# EAGLE design Breeze UAV (EAGLE 7.1.0)

## Sheet 1 of 2
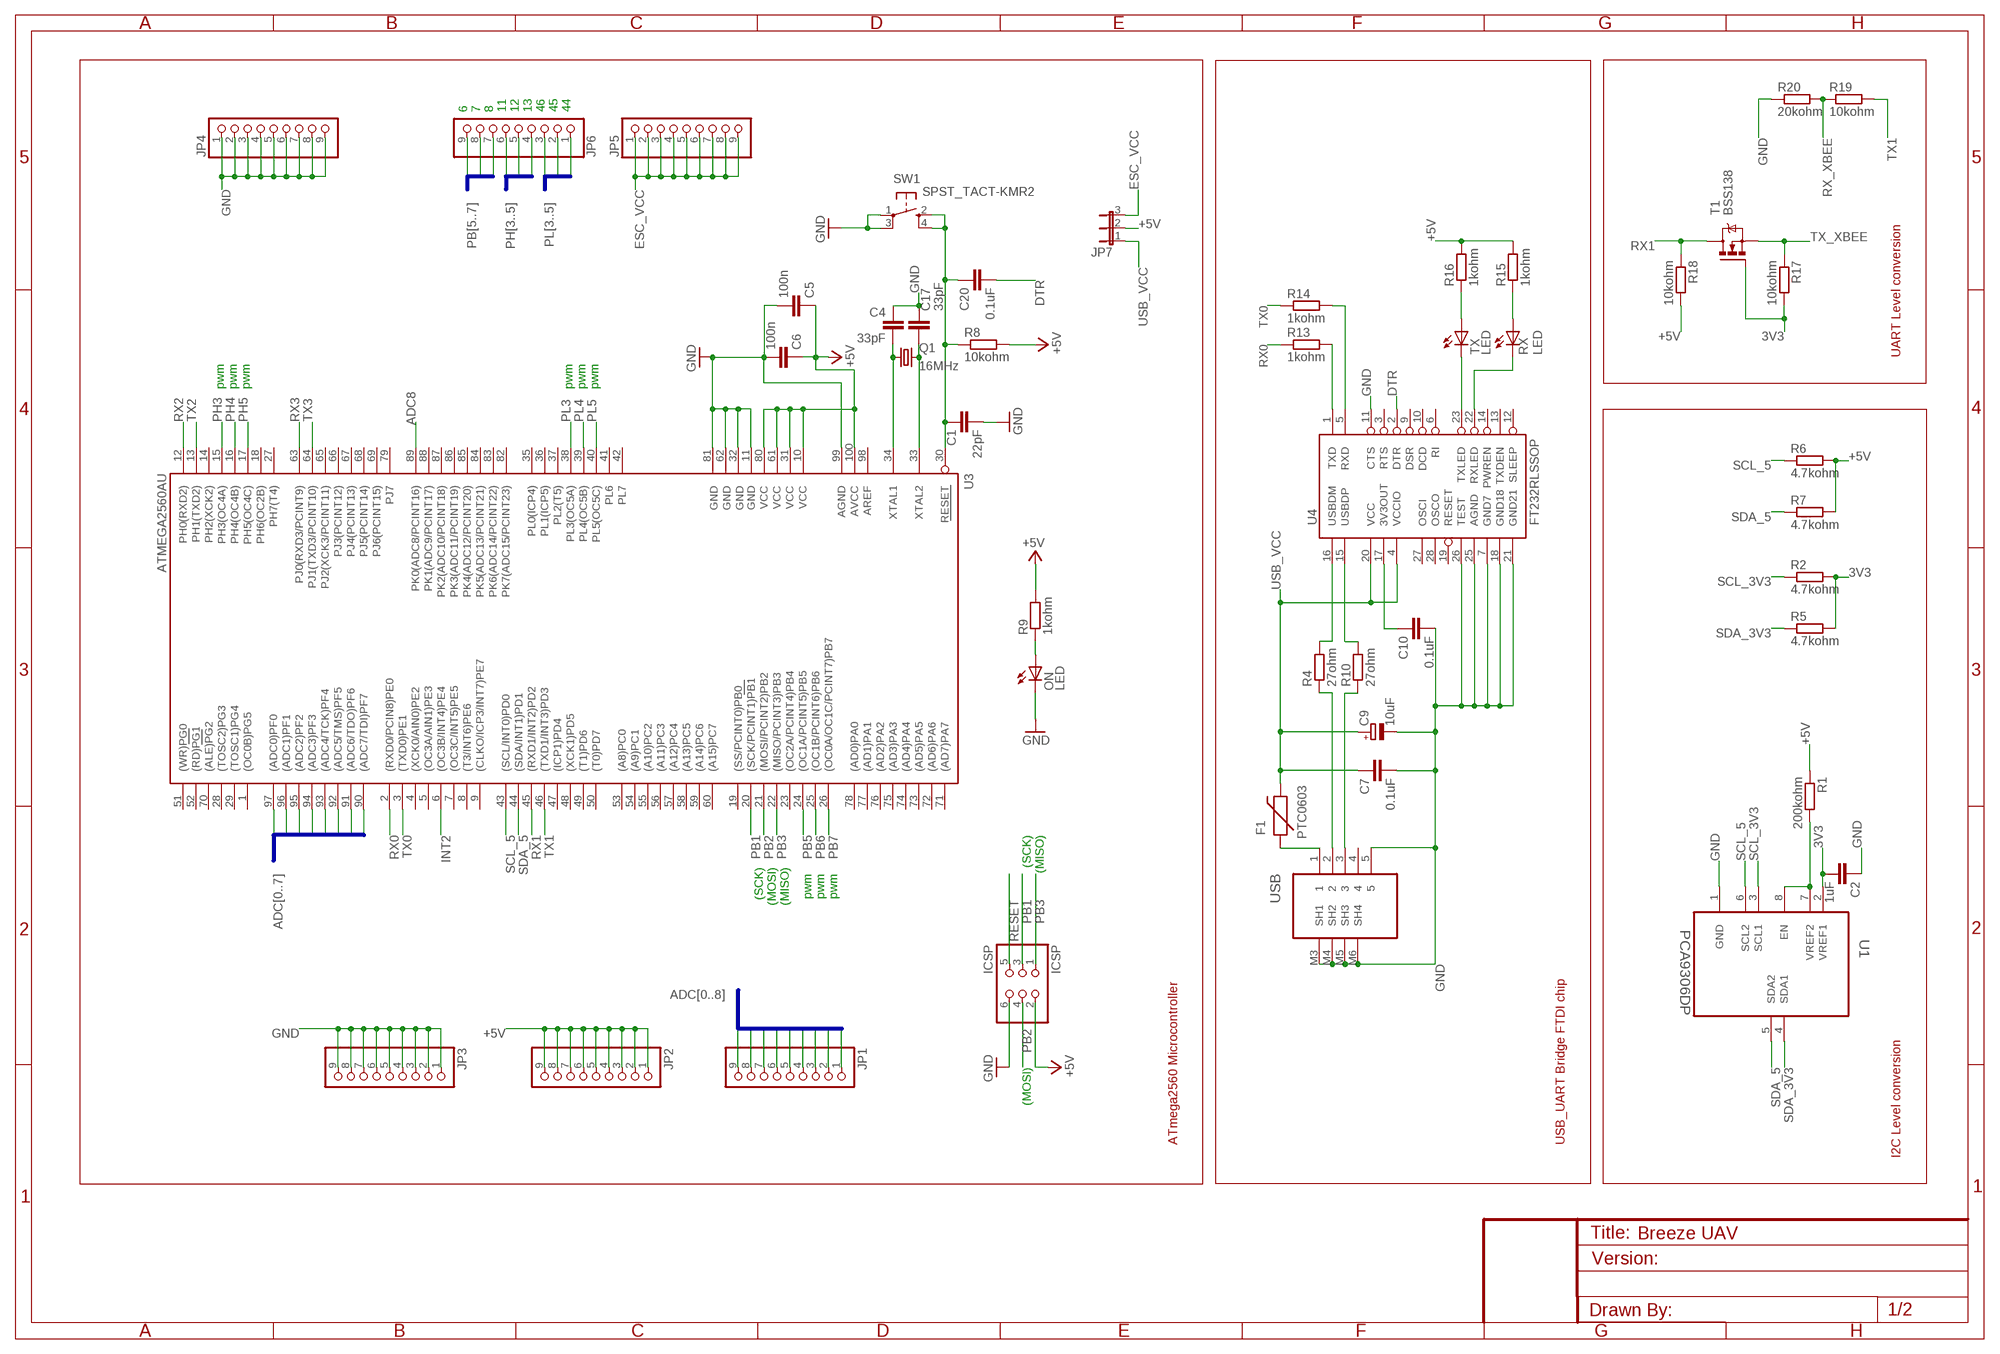
[diagram p0: schematic, sheet 1]
FRAME2 (FRAME-A3): CREVISION: 1.0; DESIGNER: Mario Avila

### Parts
C1  22pF  C-EUC0402  [C0402]
C2  1uF  C-EUC0402  [C0402]
C4  33pF  C-EUC0402  [C0402]
C5  100n  C-EUC0402  [C0402]
C6  100n  C-EUC0402  [C0402]
C7  0.1uF  C-EUC0402  [C0402]
C9  10uF  CPOL-EUSMCA  [SMC_A]
C10  0.1uF  C-EUC0402  [C0402]
C17  33pF  C-EUC0402  [C0402]
C20  0.1uF  C-EUC0402  [C0402]
F1  PTC0603  [0603]
ICSP  ICSP  PINHD-2X3  [2X03]
JP1  PINHD-1X9  [1X09]
JP2  PINHD-1X9  [1X09]
JP3  PINHD-1X9  [1X09]
JP4  PINHD-1X9  [1X09]
JP5  PINHD-1X9  [1X09]
JP6  PINHD-1X9  [1X09]
JP7  JP2E  [JP2]
ON  LED  LEDCHIPLED_0603  [CHIPLED_0603]
Q1  16MHz  CRYSTALCTS406  [CTS406]
R1  200kohm  R-EU_R0402  [R0402]
R2  4.7kohm  R-EU_R0402  [R0402]
R4  27ohm  R-EU_R0402  [R0402]
R5  4.7kohm  R-EU_R0402  [R0402]
R6  4.7kohm  R-EU_R0402  [R0402]
R7  4.7kohm  R-EU_R0402  [R0402]
R8  10kohm  R-EU_R0402  [R0402]
R9  1kohm  R-EU_R0402  [R0402]
R10  27ohm  R-EU_R0402  [R0402]
R13  1kohm  R-EU_R0402  [R0402]
R14  1kohm  R-EU_R0402  [R0402]
R15  1kohm  R-EU_R0402  [R0402]
R16  1kohm  R-EU_R0402  [R0402]
R17  10kohm  R-EU_R0402  [R0402]
R18  10kohm  R-EU_R0402  [R0402]
R19  10kohm  R-EU_R0402  [R0402]
R20  20kohm  R-EU_R0402  [R0402]
RX  LED  LEDCHIPLED_0603  [CHIPLED_0603]
SW1  SPST_TACT-KMR2  [KMR2]
T1  BSS138  [SOT23]
TX  LED  LEDCHIPLED_0603  [CHIPLED_0603]
U1  PCA9306DP  [SOP65P490X110-8N]
U3  ATMEGA2560AU  [TQFP100]
U4  FT232RLSSOP  [SSOP28DB]
USB  47346-0001  [MOLEX_47346-0001]

### Nets
3V3: C2.2 R2.2 R5.2 R17.2 T1.1(G) U1.2(VREF1) ; also sheet 2
+5V: C5.1 C6.1 ICSP.2 JP2.1 JP2.2 JP2.3 JP2.4 JP2.5 JP2.6 JP2.7 JP2.8 JP2.9 JP7.2 R1.1 R6.2 R7.2 R8.2 R9.2 R15.2 R16.2 R18.2 U3.10(VCC) U3.31(VCC1) U3.61(VCC2) U3.80(VCC3) U3.100(AVCC) ; also sheet 2
ADC0: JP1.1 U3.97((ADC0)PF0)
ADC1: JP1.2 U3.96((ADC1)PF1)
ADC2: JP1.3 U3.95((ADC2)PF2)
ADC3: JP1.4 U3.94((ADC3)PF3)
ADC4: JP1.5 U3.93((ADC4/TCK)PF4)
ADC5: JP1.6 U3.92((ADC5/TMS)PF5)
ADC6: JP1.7 U3.91((ADC6/TDO)PF6)
ADC7: JP1.8 U3.90((ADC7/TDI)PF7)
ADC8: JP1.9 U3.89(PK0(ADC8/PCINT16))
DTR: C20.2 U4.2(DTR)
ESC_VCC: JP5.1 JP5.2 JP5.3 JP5.4 JP5.5 JP5.6 JP5.7 JP5.8 JP5.9 JP7.3
GND: C1.2 C2.1 C4.1 C5.2 C6.2 C7.2 C9.- C10.2 C17.2 ICSP.6 JP3.1 JP3.2 JP3.3 JP3.4 JP3.5 JP3.6 JP3.7 JP3.8 JP3.9 JP4.1 JP4.2 JP4.3 JP4.4 JP4.5 JP4.6 JP4.7 JP4.8 JP4.9 ON.C R20.1 SW1.1(P) SW1.3(P1) U1.1(GND) U3.11(GND) U3.32(GND1) U3.62(GND2) U3.81(GND3) U3.99(AGND) U4.7(GND7) U4.11(CTS) U4.18(GND18) U4.21(GND21) U4.25(AGND) U4.26(TEST) USB.5 USB.M3(SH1) USB.M4(SH2) USB.M5(SH3) USB.M6(SH4) ; also sheet 2
INT2: U3.6((OC3B/INT4)PE4) ; also sheet 2
M8RXD: R13.2 U4.1(TXD)
N$1: R1.2 U1.7(VREF2) U1.8(EN)
N$3: ON.A R9.1
N$4: R4.1 USB.2
N$5: R10.1 USB.3
N$6: R14.2 U4.5(RXD)
N$9: R4.2 U4.16(USBDM)
N$10: R10.2 U4.15(USBDP)
N$11: R16.1 TX.A
N$12: R15.1 RX.A
N$14: RX.C U4.22(RXLED)
N$15: C10.1 U4.17(3V3OUT)
PB1: ICSP.3 U3.20((SCK/PCINT1)PB1)
PB2: ICSP.4 U3.21((MOSI/PCINT2)PB2)
PB3: ICSP.1 U3.22((MISO/PCINT3)PB3)
PB5: JP6.7 U3.24((OC1A/PCINT5)PB5)
PB6: JP6.8 U3.25((OC1B/PCINT6)PB6)
PB7: JP6.9 U3.26((OC0A/OC1C/PCINT7)PB7)
PH3: JP6.4 U3.15(PH3(OC4A))
PH4: JP6.5 U3.16(PH4(OC4B))
PH5: JP6.6 U3.17(PH5(OC4C))
PL3: JP6.3 U3.38(PL3(OC5A))
PL4: JP6.2 U3.39(PL4(OC5B))
PL5: JP6.1 U3.40(PL5(OC5C))
RESET: C1.1 C20.1 ICSP.5 R8.1 SW1.2(S) SW1.4(S1) U3.30(RESET)
RX0: R13.1 U3.2((RXD0/PCIN8)PE0)
RX1: R18.1 T1.3(D) U3.45((RXD1/INT2)PD2)
RX2: U3.12(PH0(RXD2)) ; also sheet 2
RX3: U3.63(PJ0(RXD3/PCINT9)) ; also sheet 2
RX_XBEE: R19.1 R20.2 ; also sheet 2
SCL_3V3: R2.1 U1.3(SCL1) ; also sheet 2
SCL_5: R6.1 U1.6(SCL2) U3.43((SCL/INT0)PD0) ; also sheet 2
SDA_3V3: R5.1 U1.4(SDA1) ; also sheet 2
SDA_5: R7.1 U1.5(SDA2) U3.44((SDA/INT1)PD1) ; also sheet 2
TX: TX.C U4.23(TXLED)
TX0: R14.1 U3.3((TXD0)PE1)
TX1: R19.2 U3.46((TXD1/INT3)PD3)
TX2: U3.13(PH1(TXD2)) ; also sheet 2
TX3: U3.64(PJ1(TXD3/PCINT10)) ; also sheet 2
TX_XBEE: R17.1 T1.2(S) ; also sheet 2
USB_VCC: C7.1 C9.+ F1.2 JP7.1 U4.4(VCCIO) U4.20(VCC)
VUSB: F1.1 USB.1
XTAL1: C4.2 Q1.1 U3.34(XTAL1)
XTAL2: C17.1 Q1.3 U3.33(XTAL2)
Unconnected: U3.1((OC0B)PG5) U3.4((XCK0/AIN0)PE2) U3.5((OC3A/AIN1)PE3) U3.7((OC3C/INT5)PE5) U3.8((T3/INT6)PE6) U3.9((CLKO/ICP3/INT7)PE7) U3.14(PH2(XCK2)) U3.18(PH6(OC2B)) U3.19((SS/PCINT0)PB0) U3.23((OC2A/PCINT4)PB4) U3.27(PH7(T4)) U3.28((TOSC2)PG3) U3.29((TOSC1)PG4) U3.35(PL0(ICP4)) U3.36(PL1(ICP5)) U3.37(PL2(T5)) U3.41(PL6) U3.42(PL7) U3.47((ICP1)PD4) U3.48((XCK1)PD5) U3.49((T1)PD6) U3.50((T0)PD7) U3.51((WR)PG0) U3.52((RD)PG1) U3.53((A8)PC0) U3.54((A9)PC1) U3.55((A10)PC2) U3.56((A11)PC3) U3.57((A12)PC4) U3.58((A13)PC5) U3.59((A14)PC6) U3.60((A15)PC7) U3.65(PJ2(XCK3/PCINT11)) U3.66(PJ3(PCINT12)) U3.67(PJ4(PCINT13)) U3.68(PJ5(PCINT14)) U3.69(PJ6(PCINT15)) U3.70((ALE)PG2) U3.71((AD7)PA7) U3.72((AD6)PA6) U3.73((AD5)PA5) U3.74((AD4)PA4) U3.75((AD3)PA3) U3.76((AD2)PA2) U3.77((AD1)PA1) U3.78((AD0)PA0) U3.79(PJ7) U3.82(PK7(ADC15/PCINT23)) U3.83(PK6(ADC14/PCINT22)) U3.84(PK5(ADC13/PCINT21)) U3.85(PK4(ADC12/PCINT20)) U3.86(PK3(ADC11/PCINT19)) U3.87(PK2(ADC10/PCINT18)) U3.88(PK1(ADC9/PCINT17)) U3.98(AREF) U4.3(RTS) U4.6(RI) U4.9(DSR) U4.10(DCD) U4.12(SLEEP) U4.13(TXDEN) U4.14(PWREN) U4.19(RESET) U4.27(OSCI) U4.28(OSCO) USB.4

### Buses
ADC[0..8]
ADC[0..7]
PL[3..5]
PB[5..7]
PH[3..5]

### Notes on the sheet
- 6 | 7 | 8 | 11 | 12 | 13 | 46 | 45 | 44
- UART Level conversion
- pwm | pwm | pwm | pwm | pwm | pwm
- (SCK) | (MISO)
- (SCK) | (MOSI) | (MISO)
- pwm | pwm | pwm
- (MOSI)
- ATmega2560 Microcontroller | USB_UART Bridge FTDI chip
- I2C Level conversion

## Sheet 2 of 2
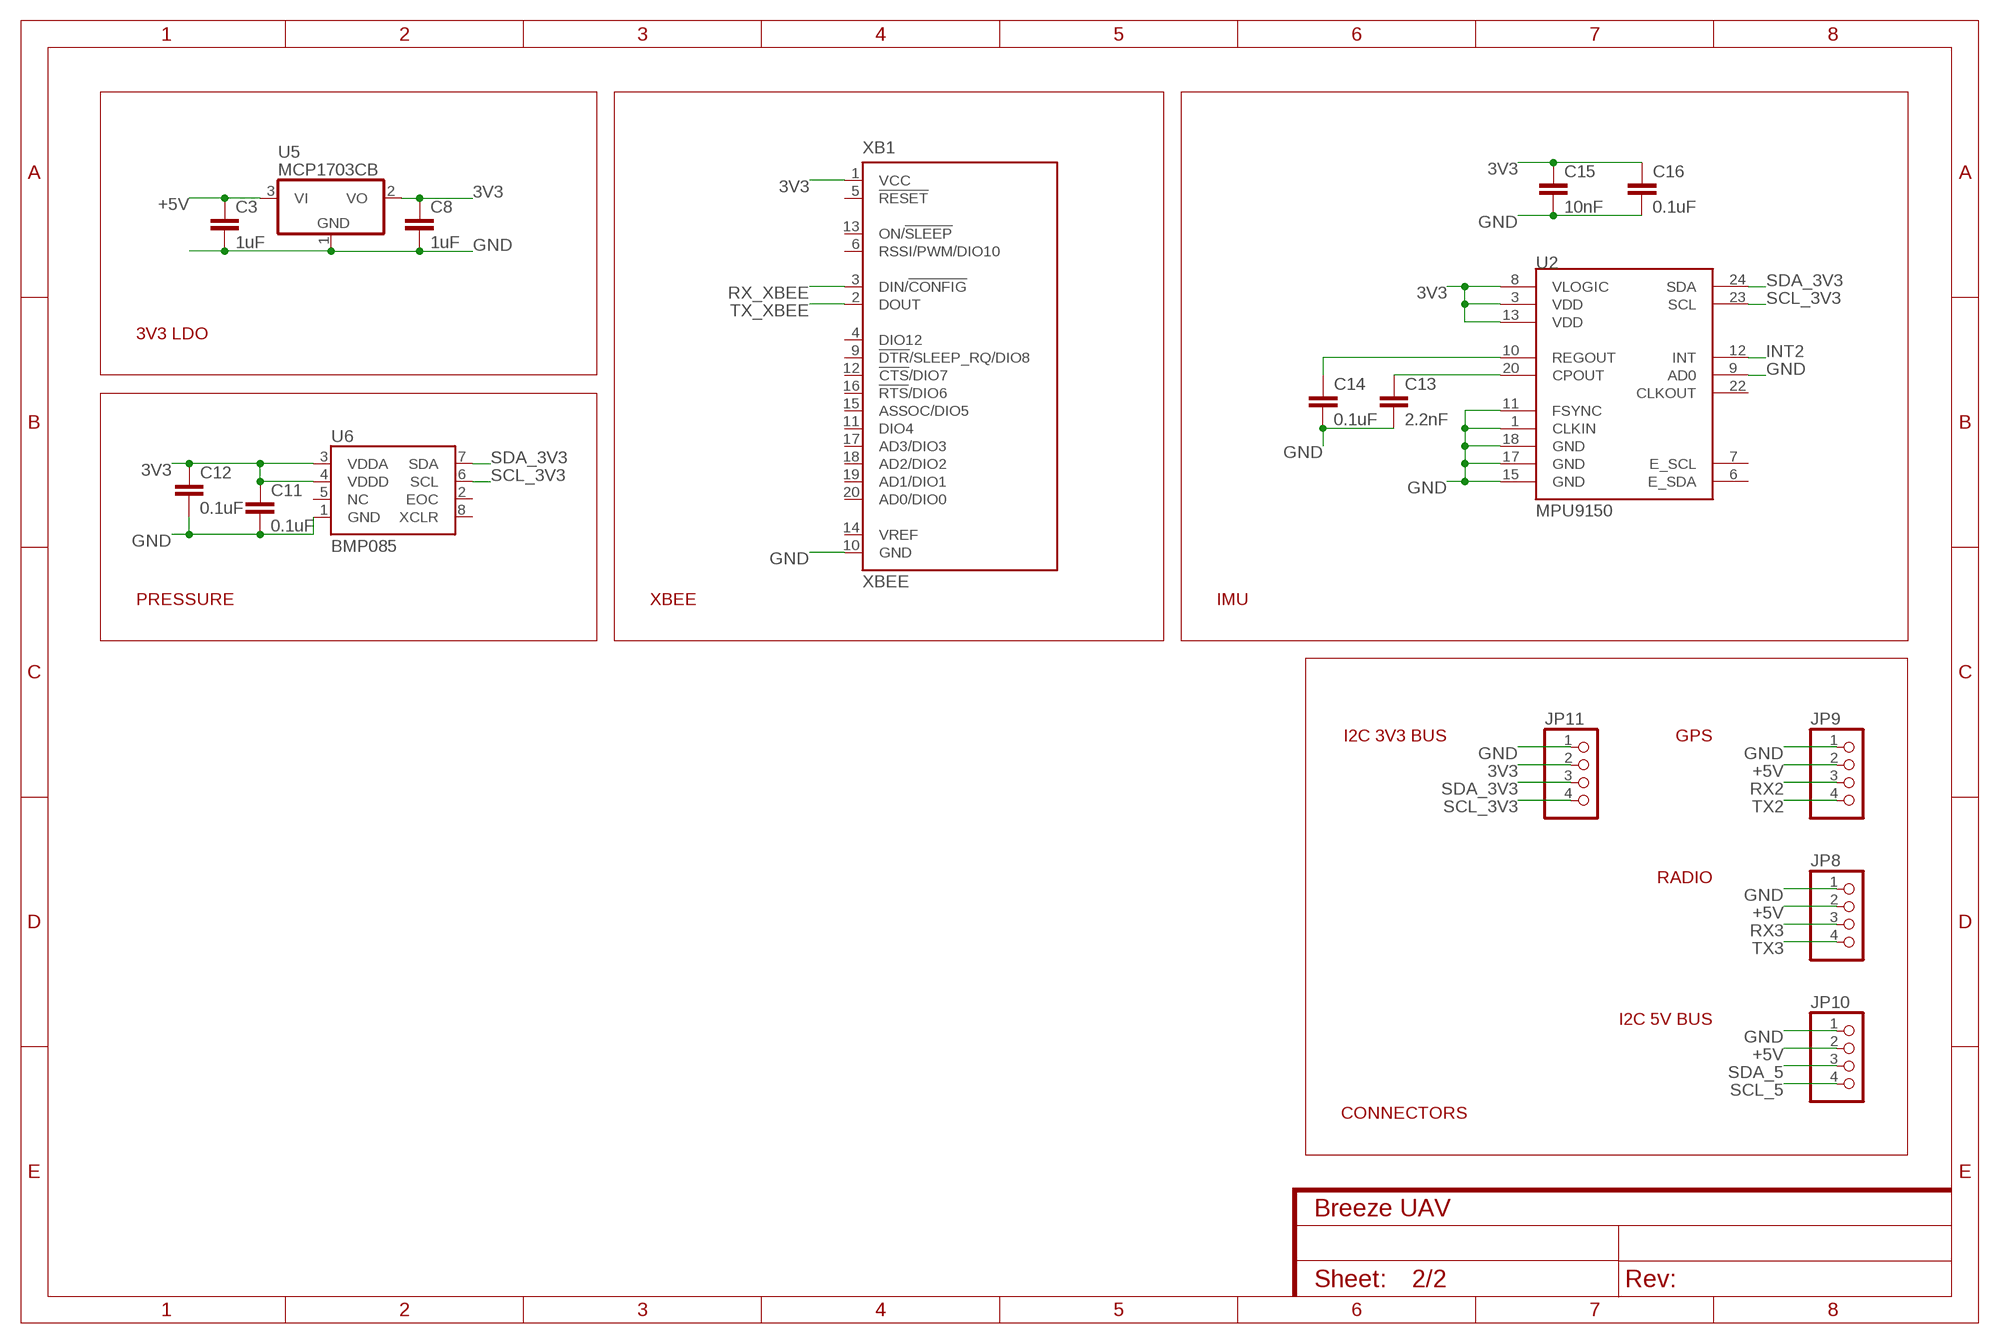
[diagram p1: schematic, sheet 2]
FRAME3 (FRAME-A4L): CREVISION: 1.0; DESIGNER: Mario Avila

### Parts
C3  1uF  C-EUC0402  [C0402]
C8  1uF  C-EUC0402  [C0402]
C11  0.1uF  C-EUC0402  [C0402]
C12  0.1uF  C-EUC0402  [C0402]
C13  2.2nF  C-EUC0402  [C0402]
C14  0.1uF  C-EUC0402  [C0402]
C15  10nF  C-EUC0402  [C0402]
C16  0.1uF  C-EUC0402  [C0402]
JP8  PINHD-1X4  [1X04]
JP9  PINHD-1X4  [1X04]
JP10  PINHD-1X4  [1X04]
JP11  PINHD-1X4  [1X04]
U2  MPU9150  MPU-9150QFN-24-NP  [QFN-24-NP]
U5  MCP1703CB  [SOT23]
U6  BMP085  [BMP085]
XB1  XBEE  [XBEE]

### Nets
3V3: C8.1 C11.1 C12.1 C15.1 C16.1 JP11.2 U2.3(VDD) U2.8(VLOGIC) U2.13(VDD) U5.2(VO) U6.3(VDDA) U6.4(VDDD) XB1.1(VCC) ; also sheet 1
+5V: C3.1 JP8.2 JP9.2 JP10.2 U5.3(VI) ; also sheet 1
GND: C3.2 C8.2 C11.2 C12.2 C13.2 C14.2 C15.2 C16.2 JP8.1 JP9.1 JP10.1 JP11.1 U2.1(CLKIN) U2.9(AD0) U2.11(FSYNC) U2.15(GND) U2.17(GND) U2.18(GND) U5.1(GND) U6.1(GND) XB1.10(GND) ; also sheet 1
INT2: U2.12(INT) ; also sheet 1
N$7: C13.1 U2.20(CPOUT)
N$8: C14.1 U2.10(REGOUT)
RX2: JP9.3 ; also sheet 1
RX3: JP8.3 ; also sheet 1
RX_XBEE: XB1.3(DIN/!CONFIG) ; also sheet 1
SCL_3V3: JP11.4 U2.23(SCL) U6.6(SCL) ; also sheet 1
SCL_5: JP10.4 ; also sheet 1
SDA_3V3: JP11.3 U2.24(SDA) U6.7(SDA) ; also sheet 1
SDA_5: JP10.3 ; also sheet 1
TX2: JP9.4 ; also sheet 1
TX3: JP8.4 ; also sheet 1
TX_XBEE: XB1.2(DOUT) ; also sheet 1
Unconnected: U2.6(E_SDA) U2.7(E_SCL) U2.22(CLKOUT) U6.2(EOC) U6.5(NC) U6.8(XCLR) XB1.4(DIO12) XB1.5(!RESET) XB1.6(RSSI/PWM/DIO10) XB1.9(!DTR!/SLEEP_RQ/DIO8) XB1.11(DIO4) XB1.12(!CTS!/DIO7) XB1.13(ON/!SLEEP) XB1.14(VREF) XB1.15(ASSOC/DIO5) XB1.16(!RTS!/DIO6) XB1.17(AD3/DIO3) XB1.18(AD2/DIO2) XB1.19(AD1/DIO1) XB1.20(AD0/DIO0)

### Notes on the sheet
- 3V3 LDO
- PRESSURE | XBEE | IMU
- I2C 3V3 BUS | GPS
- RADIO
- I2C 5V BUS
- CONNECTORS

## Library data of the parts
C1-C8 C10-C17 C20 = rcl:C-EU: CAPACITOR, European symbol
C9 = rcl:CPOL-EU: POLARIZED CAPACITOR, European symbol
F1 = SparkFun-PowerIC:PTC: Resettable Fuse PTC Resettable Fuse. Spark Fun Electronics SKU : COM-08357
ICSP = pinhead:PINHD-2X3: PIN HEADER
JP1-JP6 = pinhead:PINHD-1X9: PIN HEADER
JP7 = jumper:JP2E: JUMPER
JP8-JP11 = pinhead:PINHD-1X4: PIN HEADER
ON RX TX = adafruit:LED: LED OSRAM: - CHIPLED LG R971, LG N971, LY N971, LG Q971, LY Q971, LO R971, LY R971 LH N974, LH R974 LS Q976, LO Q976, LY Q976 LO Q996 - Hyper CHIPLED LW Q18S LB Q993, LB Q99A, LB R99A - SideLED LS A670, LO A670, LY A670, LG A670, LP A670 LB A673, LV A673, LT A673, LW A673 LH A674 LY A675 LS A676, LA A676, LO A676, LY A676, LW A676 LS A679, LY A679, LG A679 - Hyper Micro SIDELED® LS Y876, LA Y876, LO Y876, LY Y876 LT Y87S - SmartLED LW L88C, LW L88S LB L89C, LB L89S, LG L890 LS L89K, LO L89K, LY L89K LS L896, LA L896, LO L896, LY L896 - TOPLED LS T670, LO T670, LY T670, LG T670, LP T670 LSG T670, LSP T670, LSY T670, LOP T670, LYG T670 LG T671, LOG T671, LSG T671 LB T673, LV T673, LT T673, LW T673 LH T674 LS T676, LA T676, LO T676, LY T676, LB T676, LH T676, LSB T676, LW T676 LB T67C, LV T67C, LT T67C, LS T67K, LO T67K, LY T67K, LW E67C LS E67B, LA E67B, LO E67B, LY E67B, LB E67C, LV E67C, LT E67C LW T67C LS T679, LY T679, LG T679 LS T770, LO T770, LY T770, LG T770, LP T770 LB T773, LV T773, LT T773, LW T773 LH T774 LS E675, LA E675, LY E675, LS T675 LS T776, LA T776, LO T776, LY T776, LB T776 LHGB T686 LT T68C, LB T68C - Hyper Mini TOPLED® LB M676 - Mini TOPLED Santana® LG M470 LS M47K, LO M47K, LY M47K Source: http://www.osram.convergy.de/
Q1 = crystal:CRYSTAL: CRYSTAL; OC_FARNELL: unknown; OC_NEWARK: unknown
R1 R2 R4-R10 R13-R20 = rcl:R-EU_: RESISTOR, European symbol
SW1 = adafruit:SPST_TACT: SMT 6mm switch, EVQQ2 series http://www.ladyada.net/library/eagle
T1 = fairchild-semic:BSS138
U1 = NXP:PCA9306DP: Dual bidirectional I2C-bus and SMBus voltage-level translator,TSSOP8; MPN: PCA9306DP; OC_FARNELL: 2212072; OC_NEWARK: 55W4296; PACKAGE: TSSOP-8; SUPPLIER: NXP
U2 = SparkFun-Sensors:MPU-9150: 9DOF (3mag, 3accel, 3rotat). I2C interface.
U3 = SparkFun-DigitalIC:ATMEGA2560: Atmel 100-pin 8-bit uC 64/128/256 Kbytes FLASH 4 Kbytes EEPROM 8 Kbytes SRAM 86 General Purpose I/O pins 12-channels16-bit PWM 4 x Serial USARTs 16-channels 10-bit A/D
U4 = SparkFun-DigitalIC:FT232RL: USB UART FT232RL 4th Generation USB UART (USB <-> Serial) Controller. Spark Fun Electronics SKU : COM-00650 Production SKU IC-00870; PROD_ID: IC-00870
U5 = linear:MCP1703: 250 mA, 16V, Low Quiescent Current LDO Regulator Source: http://ww1.microchip.com/downloads/en/DeviceDoc/22049b.pdf
U6 = SparkFun-Sensors:BMP085: BMP085 Pressure Sensor Great little MEMS pressure sensor. SKU: COM-09603
USB = Molex-47346-0001:47346-0001: CONN RCPT 5POS MICRO USB R/A SMD; MPN: 47346-0001; OC_FARNELL: 1568026; OC_NEWARK: 47M0505; PACKAGE: 5 POS MICRO USB R/A; SUPPLIER: MOLEX
XB1 = xbee:XBEE: XBee (TM) /XBee-PRO(TM) OEM RF Modules Source: MaxStream, Inc. xbee_productmanual.pdf; MPN: XBP24-Z7UIT-004; OC_FARNELL: 1751799; OC_NEWARK: 34R5507

## Net classes
0 default: width 0.152 mm, drill 0.305 mm, clearance 0.152 mm

## Board
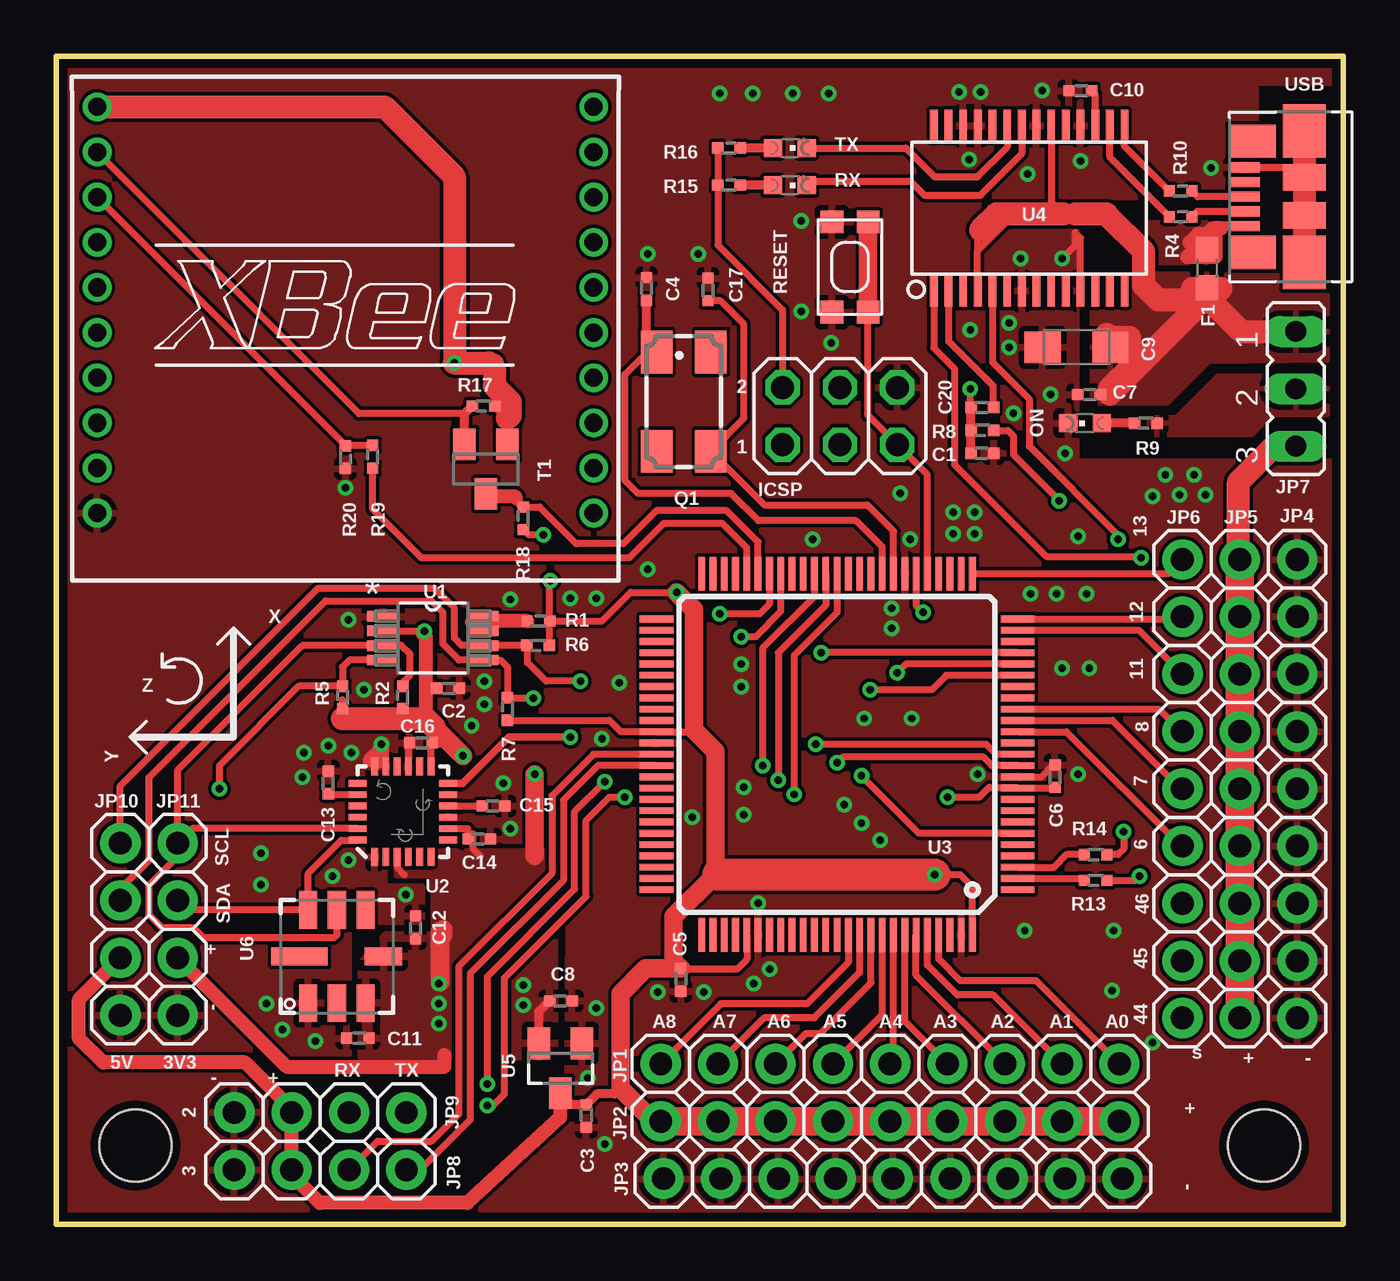
[diagram p2: board, top side]
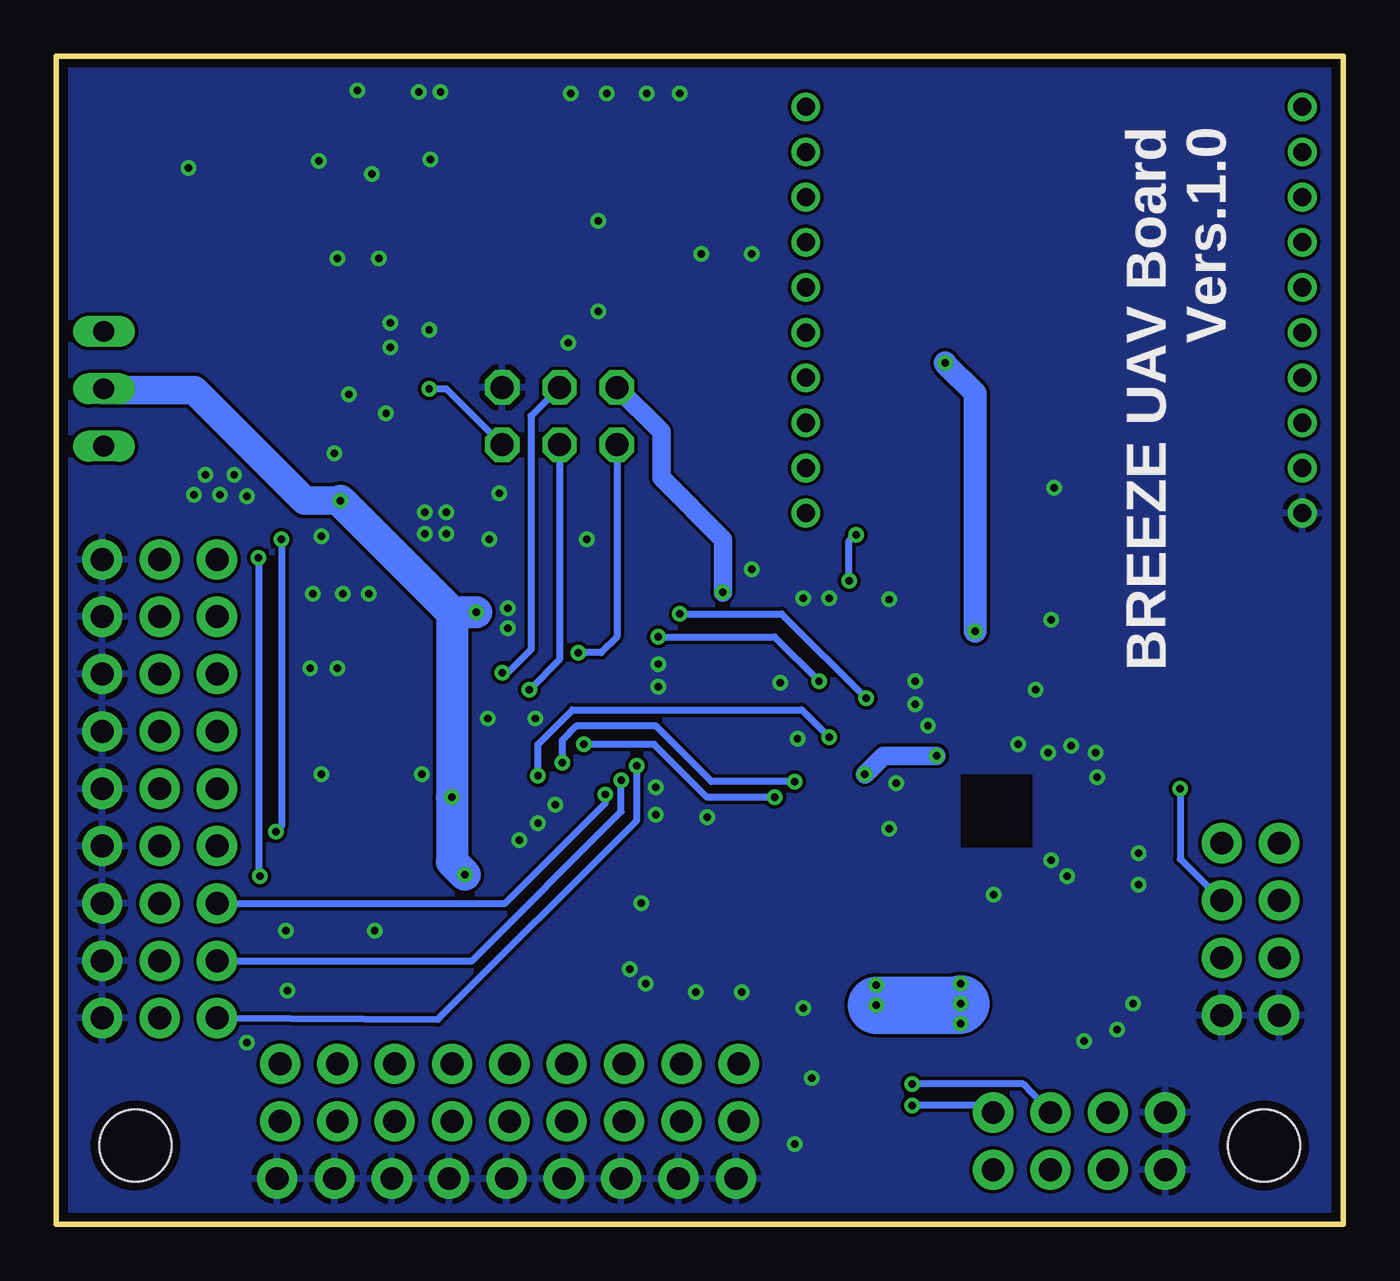
[diagram p3: board, bottom side, seen from below]

Size 57 x 51.75 mm. Coordinates in mm from the lower left corner, seen from the top.
Outline: 57,0 0,0 0,51.75 57,51.75 57,0
Copper layers (1*16): Top 0.0356mm / dielectric 1.5011mm / Bottom 0.0356mm
Design rules "OSH Park": minimum track width 6mil, minimum drill 13mil, track to track 6mil, track to pad 6mil, pad to pad 6mil, via to via 6mil, smd to smd 6mil, copper to edge 15mil, drill to drill 6mil, minimum pad ring 7mil, minimum via ring 7mil, stop-mask expansion 3mil, vias tented up to drill 0mil, thermal gap 10mil
Holes 3.2 mm at 53.5,3.5 3.5,3.5

### Footprints (pad centres in the part's own frame; a part is rotated, then mirrored left to right if it is on the bottom)
C0402 = smd 0.5 x 0.5: 1 -0.35,0; 2 0.65,0
SMC_A = smd 1.6 x 1.4: + -1.5,0; - 1.5,0
0603 = smd 1.1 x 1: 1 -0.85,0; 2 0.85,0
2X03 = drill 1.016 octagon: 1 -2.54,-1.27; 2 -2.54,1.27; 3 0,-1.27; 4 0,1.27; 5 2.54,-1.27; 6 2.54,1.27
1X09 = drill 1.016 pad 1.778: 1 -10.16,0; 2 -7.62,0; 3 -5.08,0; 4 -2.54,0; 5 0,0; 6 2.54,0; 7 5.08,0; 8 7.62,0; 9 10.16,0
JP2 = drill 0.914 long: 1 -2.54,0; 2 0,0; 3 2.54,0
1X04 = drill 1.016 pad 1.778: 1 -3.81,0; 2 -1.27,0; 3 1.27,0; 4 3.81,0
CHIPLED_0603 = smd 0.8 x 0.8: A 0,-0.75; C 0,0.75
CTS406 = smd 1.9 x 1.4: 1 -2.2,-1.2; 2 2.2,-1.2; 3 2.2,1.2; 4 -2.2,1.2
R0402 = smd 0.5 x 0.5: 1 -0.35,0; 2 0.65,0
KMR2 = smd 1 x 1: 1 2,0.8; 2 2,-0.8; 3 -2,0.8; 4 -2,-0.8
SOT23 = smd 1 x 1.4: 1 -0.95,-1.1; 2 0.95,-1.1; 3 0,1.1
SOP65P490X110-8N = smd 1.422 x 0.457: 1 -2.21,0.965; 2 -2.21,0.33; 3 -2.21,-0.33; 4 -2.21,-0.965; 5 2.21,-0.965; 6 2.21,-0.33; 7 2.21,0.33; 8 2.21,0.965
QFN-24-NP = smd 0.8 x 0.3: 1 -2,1.25; 2 -2,0.75; 3 -2,0.25; 4 -2,-0.25; 5 -2,-0.75; 6 -2,-1.25; 13 2,-1.25; 14 2,-0.75; 15 2,-0.25; 16 2,0.25; 17 2,0.75; 18 2,1.25 | smd 0.3 x 0.8: 7 -1.25,-2; 8 -0.75,-2; 9 -0.25,-2; 10 0.25,-2; 11 0.75,-2; 12 1.25,-2; 19 1.25,2; 20 0.75,2; 21 0.25,2; 22 -0.25,2; 23 -0.75,2; 24 -1.25,2
TQFP100 = smd 1.5 x 0.3: 1 -8,6; 2 -8,5.5; 3 -8,5; 4 -8,4.5; 5 -8,4; 6 -8,3.5; 7 -8,3; 8 -8,2.5; 9 -8,2; 10 -8,1.5; 11 -8,1; 12 -8,0.5; 13 -8,0; 14 -8,-0.5; 15 -8,-1; 16 -8,-1.5; 17 -8,-2; 18 -8,-2.5; 19 -8,-3; 20 -8,-3.5; 21 -8,-4; 22 -8,-4.5; 23 -8,-5; 24 -8,-5.5; 25 -8,-6; 51 8,-6; 52 8,-5.5; 53 8,-5; 54 8,-4.5; 55 8,-4; 56 8,-3.5; 57 8,-3; 58 8,-2.5; 59 8,-2; 60 8,-1.5; 61 8,-1; 62 8,-0.5; 63 8,0; 64 8,0.5; 65 8,1; 66 8,1.5; 67 8,2; 68 8,2.5; 69 8,3; 70 8,3.5; 71 8,4; 72 8,4.5; 73 8,5; 74 8,5.5; 75 8,6 | smd 0.3 x 1.5: 26 -6,-8; 27 -5.5,-8; 28 -5,-8; 29 -4.5,-8; 30 -4,-8; 31 -3.5,-8; 32 -3,-8; 33 -2.5,-8; 34 -2,-8; 35 -1.5,-8; 36 -1,-8; 37 -0.5,-8; 38 0,-8; 39 0.5,-8; 40 1,-8; 41 1.5,-8; 42 2,-8; 43 2.5,-8; 44 3,-8; 45 3.5,-8; 46 4,-8; 47 4.5,-8; 48 5,-8; 49 5.5,-8; 50 6,-8; 76 6,8; 77 5.5,8; 78 5,8; 79 4.5,8; 80 4,8; 81 3.5,8; 82 3,8; 83 2.5,8; 84 2,8; 85 1.5,8; 86 1,8; 87 0.5,8; 88 0,8; 89 -0.5,8; 90 -1,8; 91 -1.5,8; 92 -2,8; 93 -2.5,8; 94 -3,8; 95 -3.5,8; 96 -4,8; 97 -4.5,8; 98 -5,8; 99 -5.5,8; 100 -6,8
SSOP28DB = smd 0.348 x 1.397: 1 -4.225,-3.656; 2 -3.575,-3.656; 3 -2.925,-3.656; 4 -2.275,-3.656; 5 -1.625,-3.656; 6 -0.975,-3.656; 7 -0.325,-3.656; 8 0.325,-3.656; 9 0.975,-3.656; 10 1.625,-3.656; 11 2.275,-3.656; 12 2.925,-3.656; 13 3.575,-3.656; 14 4.225,-3.656; 15 4.225,3.656; 16 3.575,3.656; 17 2.925,3.656; 18 2.275,3.656; 19 1.625,3.656; 20 0.975,3.656; 21 0.325,3.656; 22 -0.325,3.656; 23 -0.975,3.656; 24 -1.625,3.656; 25 -2.275,3.656; 26 -2.925,3.656; 27 -3.575,3.656; 28 -4.225,3.656
BMP085 = smd 1.67 x 0.8: 1 -2.065,1.27; 2 -2.065,0; 3 -2.065,-1.27; 5 2.065,-1.27; 6 2.065,0; 7 2.065,1.27 | smd 0.8 x 1.67: 4 0,-2.065 | smd 0.8 x 2.5: 8 0,1.65
MOLEX_47346-0001 = smd 0.45 x 1.38: 1 -1.3,0; 2 -0.65,0; 3 0,0; 4 0.65,0; 5 1.3,0 | smd 1.475 x 2.1: M1 -2.462,-0.36; M2 2.462,-0.36 | smd 2.375 x 1.9: M3 -2.913,-2.66; M6 2.913,-2.66 | smd 1.175 x 1.9: M4 -0.82,-2.66; M5 0.85,-2.66
XBEE = drill 0.8 pad 1.27: 1 -11,9; 2 -11,7; 3 -11,5; 4 -11,3; 5 -11,1; 6 -11,-1; 7 -11,-3; 8 -11,-5; 9 -11,-7; 10 -11,-9; 11 11,-9; 12 11,-7; 13 11,-5; 14 11,-3; 15 11,-1; 16 11,1; 17 11,3; 18 11,5; 19 11,7; 20 11,9

### Placement (x,y rotation side)
C1  40.87,34.16 0 top
C2  17.5,23.75 180 top
C3  23.47,4.95 270 top
C4  26.14,41.59 270 top
C5  27.66,10.99 270 top
C6  44.24,19.71 90 top
C7  45.89,36.77 180 top
C8  22.2,9.91 0 top
C9  45.19,38.86 180 top
C10  45.51,50.23 180 top
C11  13.5,8.26 180 top
C12  15.92,13.02 90 top
C13  12.04,19.43 90 top
C14  19.22,18.54 0 top
C15  18.58,17.08 0 top
C16  16.3,21.34 180 top
C17  28.87,41.28 90 top
C20  40.87,36.2 0 top
F1  50.97,42.36 270 top
ICSP  34.71,35.82 0 top
JP1  36.93,7.11 180 top
JP2  36.93,4.57 180 top
JP3  37.06,2.03 180 top
JP4  54.97,19.31 270 top
JP5  52.43,19.31 270 top
JP6  49.89,19.31 90 top
JP7  54.9,37.02 270 top
JP8  11.69,2.42 0 top
JP9  11.69,4.96 0 top
JP10  2.83,13.08 90 top
JP11  5.37,13.08 90 top
ON  45.57,35.5 90 top
Q1  27.79,36.45 270 top
R1  21.5,26.73 180 top
R2  15.34,23.5 270 top
R4  49.95,44.64 180 top
R5  12.68,23.5 270 top
R6  21.19,25.66 0 top
R7  19.98,22.99 270 top
R8  40.87,35.18 0 top
R9  48.11,35.5 0 top
R10  49.95,45.79 180 top
R13  45.89,15.24 0 top
R14  45.89,16.38 0 top
R15  29.95,46.04 180 top
R16  29.95,47.69 180 top
R17  18.77,36.26 0 top
R18  20.68,31.43 270 top
R19  14.01,34.16 270 top
R20  12.8,33.85 90 top
RX  32.49,46.04 270 top
SW1  35.16,42.42 90 top
T1  19.03,33.47 180 top
TX  32.49,47.69 270 top
U1  16.68,25.97 0 top
U2  15.34,18.29 90 top
U3  34.58,20.83 180 top
U4  43.09,45.02 0 top
U5  22.33,6.92 180 top
U6  12.42,11.88 90 top
USB  52.62,45.53 90 top
XB1  12.8,40.51 0 top

### Tracks (layer width: path | path; a pad name or v marks a point on that pad's centre or on a via)
3V3  (via drill 0.33)
  Top 0.305: 19.41,37.02 19.41,36.28 R17.2 | 12.66,23.24 R5.2 12.68,22.42 | R2.2 15.34,22.48 15.41,22.42 | 16.23,26.16 16.09,26.3 U1.2 16.28,26.3 v16.3,26.29 | C2.2 16.36,23.75 | U2.8 18.22,17.54 C15.1 18.46,17.3 18.46,16.64 18.77,16.32 | U2.3 15.09,15.81 15.41,15.5 | U2.13 16.59,21.29 C16.1
  Top 0.406: T1.1 19.98,35.71 R17.2 | U5.2 21.38,9.43 C8.1 | C16.1 17.12,21.34 17.28,21.5
  Top 0.61: T1.1 20.15,34.57 | 16.23,26.16 16.36,26.04 16.36,23.75 16.36,22.42 | 19.41,38.16 19.28,38.16 | JP11.2 10.2,6.99 17.19,6.99 17.19,7.49
  Top 0.813: 19.41,38.16 19.41,37.91 | 17.12,12.83 17.12,13.08 16.99,12.96 16.99,10.73 | v21.19,19.94 21.19,16.32 | v18.01,20.77 17.28,21.5 16.74,22.04
  Top 1.016: 12.68,22.42 15.41,22.42 16.36,22.42 16.74,22.04 | 19.98,35.71 20.11,35.84 20.11,36.45 19.41,37.15 19.41,37.91 19.15,38.16 v17.63,38.16 17.63,46.42 14.54,49.51 XB1.1
  Bottom 0.813: v18.01,20.77 20.36,20.77 v21.19,19.94
  Bottom 1.016: v16.3,26.29 16.3,36.83 v17.63,38.16
  Bottom 2.54: v20.68,9.72 16.99,9.72 v16.93,9.78
  other vias: 20.68,10.61 16.93,10.67 16.93,8.89
  pour Top: 22.07,16.51 15.09,16.51 15.09,15.5 16.74,15.5 16.74,12.83 14.58,12.83 13.5,11.56 13.5,7.43 22.07,7.43
+5V  (via drill 0.33)
  Top 0.305: R16.2 R15.2 29.3,43.39 32.17,40.51 ICSP.2 | R8.2 42.14,35.18 42.39,34.93 42.39,34.1 v44.43,32.07 | v38.9,15.5 40.05,15.5 40.58,14.96 U3.100 | v39.47,18.92 40.87,18.92 41.31,19.37 41.35,19.33 U3.10 44.21,19.33 C6.1 | C5.1 27.7,11.3 30.14,11.3 30.58,11.75 U3.80 | 27.35,27.88 v27.47,28.01 25.44,28.01 24.17,26.74 R1.1 | R7.2 24.5,22.34 25.01,21.83 U3.61 28.15,21.83 28.23,21.91 | R6.2 21.84,26.72 R1.1 | U3.31 38.08,27.43 v38.39,27.12 | R1.1 21.85,28.48 v21.88,28.51 | v21.57,30.54 20.92,30.54 R18.2
  Top 0.406: U5.3 22.85,5.3 C3.1 23.95,5.78 24.74,5.78 25,6.03
  Top 0.61: U5.3 22.33,4.76 18.2,0.95 11.66,0.95 10.42,2.19 JP8.2 JP9.2 10.42,5.11 8.36,7.18 2.07,7.18 0.99,8.26 0.99,9.97 JP10.2
  Top 0.813: 26.71,4.64 JP2.9 26.46,4.57 25,6.03 25,10.22 26.11,11.34 C5.1 27.35,11.65 27.35,13.65 29.19,15.5 | 29.19,15.5 29.31,15.5 | 29.19,15.5 29.19,20.96 28.23,21.91 28.23,27.24 v27.47,28.01
  Top 1.27: JP2.1 JP2.2 JP2.3 JP2.4 JP2.5 JP2.6 JP2.7 JP2.8 JP2.9
  Top 1.422: v38.9,15.5 29.31,15.5
  Bottom 0.305: v21.88,28.51 21.88,30.29 v21.57,30.54
  Bottom 0.813: v27.47,28.01 27.47,30.35 30.2,33.08 30.2,35.12 ICSP.2
  Bottom 1.27: v44.43,32.07 46.01,32.07 50.9,36.96 54.97,36.96 JP7.2
  Bottom 1.422: v38.39,27.12 39.47,27.12 | 39.47,27.12 v44.43,32.07 | 39.47,27.12 v39.47,18.92 39.47,16.07 v38.9,15.5
  pour Top: 56.3,37.59 51.48,37.59 49.63,35.75 48.43,35.75 48.43,34.99 52.94,34.99 53.82,35.88 56.3,35.88
ADC0
  Top 0.305: U3.97 39.08,11.76 40.05,10.8 43.41,10.8 JP1.1
ADC1
  Top 0.305: U3.96 38.58,11.5 39.92,10.16 41.51,10.16 JP1.2
ADC2
  Top 0.305: U3.95 38.08,11.04 JP1.3
ADC3
  Top 0.305: U3.94 37.58,9 JP1.4
ADC4
  Top 0.305: JP1.5 37.08,7.26 U3.93
ADC5
  Top 0.305: JP1.6 36.58,9.3 U3.92
ADC6
  Top 0.305: U3.91 36.08,10.71 33.82,8.45 33.19,8.45 JP1.7
ADC7
  Top 0.305: U3.90 35.58,11.16 33.57,9.15 31.35,9.15 JP1.8
ADC8
  Top 0.305: U3.89 35.08,11.61 33.25,9.78 29.44,9.78 JP1.9
DTR
  Top 0.305: 41.57,36.25 C20.2 41.51,36.21 41.51,37.15 39.54,39.12 39.54,41.35 U4.2
ESC_VCC
  Top 1.016: JP7.3 53.95,34.48 52.36,32.89 52.36,29.53 JP5.1
  Top 1.27: JP5.9 JP5.8 JP5.7 JP5.6 JP5.5 JP5.4 JP5.3 JP5.2 JP5.1
GND  (via drill 0.33)
  Top 0.305: USB.5 54.83,46.83 USB.M5 | C6.2 44.15,20.36 43.6,19.81 42.59,19.81 | U4.11 45.37,43.7 45.13,43.94 45.13,43.37 v44.55,42.8 | U2.15 15.59,21.29 C16.2 | 14.58,20.3 U2.17 | 14.26,20.51 14.39,20.51 14.58,20.32 14.58,21.08 v14.39,21.27
  Top 0.61: 14.26,20.96 13.88,20.58 14.2,20.58 14.26,20.51
  Top 1.016: USB.M6 USB.M5 USB.M4 USB.M3
  other vias: 45.38,47.12 43.66,50.23 28.43,42.99 42.71,42.8 51.16,46.8 43.03,46.55 30.9,10.67 31.6,11.3 44.05,36.77 44.68,34.16 42.2,38.86 42.2,39.94 48.55,32.26 49.76,32.32 50.9,32.32 50.4,33.21 49.13,33.21 45.25,30.48 43.16,27.94 44.3,27.94 45.63,27.94 40.68,30.61 39.73,30.61 39.73,31.56 40.68,31.56 33,44.45 26.2,42.99 34.33,39.05 33,40.45 40.49,39.63 42.39,35.94 37.38,32.39 40.43,47.18 39.98,50.17 40.93,50.17 45.25,19.94 40.81,19.94 37.82,30.35 37,27.31 37,26.42 28.68,10.29 26.65,10.29 33.51,30.35 44.55,24.64 45.76,24.64 42.9,13.02 46.84,13.02 46.78,10.35 12.8,32.64 24.3,3.56 23.92,9.59 23.54,6.48 24.93,24 24.17,21.53 22.77,27.75 23.92,27.75 26.2,29.02 20.11,27.69 12.93,26.8 37.89,22.42 35.79,22.42 30.46,18.16 30.46,19.37 18.39,22.1 9.06,15.05 9.06,16.45 12.93,16.13 12.23,15.43 9.31,9.78 10.01,8.64 13.06,20.89 12.04,21.21 10.96,20.89 10.9,19.81 18.96,24.07 18.96,23.05 15.47,14.61 20.11,17.53 19.79,19.56 11.47,8.13 28.17,18.04 31.09,14.23 34.9,18.61 35.66,17.78 36.49,17.02 30.33,24.83 30.33,23.81 34.2,50.1 29.38,50.1 30.84,50.1 32.62,50.1 48.55,8.07 13.63,23.69
  pour Bottom: 57.06,-0.06 0.04,-0.06 0.04,51.75 57.06,51.75
  pour Top: 0.1,0.07 57.06,0.07 57.06,33.78 45.19,33.78 45.19,45.53 53.13,45.53 53.13,50.61 56.94,50.61 56.94,51.76 -0.02,51.75 -0.02,28.64 16.99,28.64 17.06,17.02 22.71,17.02 22.65,6.67 0.1,6.67
  pour Top: 0.04,29.21 16.8,29.21 16.8,18.99 14.52,18.99 14.52,13.59 12.93,13.59 12.93,0 0.04,0
  pour Top: 16.17,13.4 14.26,13.4 14.26,14.99 16.17,14.99
INT2  (via drill 0.33)
  Top 0.305: U3.6 38.21,17.33 v35.66,19.88
  Top 0.33: U2.12 17.99,19.54 20.04,21.59 v22.77,21.59
  Bottom 0.305: v35.66,19.88 35.66,21.27 34.14,22.8 23.98,22.8 v22.77,21.59
M8RXD  (via drill 0.33)
  Top 0.305: R13.2 47.79,15.24 v47.98,15.43 | v48.05,29.53 47.98,29.59 43.86,29.59 39.79,33.66 39.79,37.91 38.87,38.83 U4.1
  Bottom 0.305: v48.05,29.53 48.05,15.5 v47.98,15.43
N$1
  Top 0.305: 18.62,26.67 18.62,26.57 U1.7
  Top 0.61: R1.2 19.54,26.74 19.47,26.67 18.62,26.67 | 18.39,26.67 18.62,26.67 | 18.62,26.67 U1.8
N$2
  cutout Top: 13.76,19.94 13.76,16.7 16.93,16.7 16.93,19.94
N$3
  Top 0.406: R9.1 ON.A
N$4
  Top 0.305: USB.2 50.54,44.88 R4.1
N$5
  Top 0.305: USB.3 50.56,45.53 R10.1
N$6  (via drill 0.33)
  Top 0.305: U4.5 41.47,38.2 43.09,36.58 43.09,34.48 47.03,30.54 v47.03,30.35 | v47.28,17.4 47.28,16.64 47.03,16.38 R14.2
  Bottom 0.305: v47.03,30.35 47.03,17.65 v47.28,17.4
N$7
  Top 0.305: 12.06,19.04 C13.1 12.08,19.04 U2.20
N$8
  Top 0.305: U2.10 18.29,18.54 C14.1
N$9
  Top 0.305: R4.2 46.67,47.28 U4.16
N$10
  Top 0.305: R10.2 47.32,47.77 U4.15
N$11
  Top 0.406: TX.A R16.1
N$12
  Top 0.406: RX.A R15.1
N$14
  Top 0.305: U4.22 42.77,47.43 40.93,45.59 38.46,45.59 37.82,46.23 33.43,46.23 RX.C
N$15
  Top 0.305: U4.17 46.02,50.07 C10.1
N$16
  cutout Bottom: 13.76,19.94 13.76,16.7 16.93,16.7 16.93,19.94
PB1  (via drill 0.33)
  Top 0.305: v36.05,23.69 38.78,23.69 39.42,24.33 U3.20
  Bottom 0.305: ICSP.3 34.71,25.02 v36.05,23.69
PB2  (via drill 0.33)
  Top 0.305: U3.21 37.63,24.83 v37.25,24.45
  Bottom 0.305: ICSP.4 35.98,35.82 35.98,25.47 37,24.45 v37.25,24.45
PB3  (via drill 0.33)
  Top 0.305: U3.22 33.89,25.33 v33.89,25.34
  Bottom 0.305: ICSP.1 32.17,26.04 32.87,25.34 v33.89,25.34
PB5
  Top 0.305: U3.24 47.94,26.33 JP6.7
PB6
  Top 0.305: 49.83,26.87 JP6.8 49.79,26.83 U3.25
PB7
  Top 0.305: JP6.9 49.25,28.83 U3.26
PH3
  Top 0.305: U3.15 44.75,21.83 49.81,16.77 JP6.4
PH4
  Top 0.305: U3.16 46.79,22.33 49.81,19.31 JP6.5
PH5
  Top 0.305: U3.17 48.83,22.83 49.81,21.85 JP6.6
PL3  (via drill 0.33)
  Top 0.305: v32.68,19.05 32.68,25.21 34.58,27.12 U3.38
  Bottom 0.305: JP6.3 37.12,14.23 32.68,18.67 v32.68,19.05
PL4  (via drill 0.33)
  Top 0.305: v31.98,19.69 31.98,25.34 34.08,27.44 U3.39
  Bottom 0.305: JP6.2 38.59,11.69 31.98,18.29 v31.98,19.69
PL5  (via drill 0.33)
  Top 0.305: v31.28,20.32 31.28,25.53 33.58,27.83 U3.40
  Bottom 0.305: JP6.1 40.11,9.08 31.28,17.91 v31.28,20.32
RESET  (via drill 0.33)
  Top 0.305: C20.1 40.49,36.23 v40.49,37.02 | ICSP.5 37.63,34.16 | ICSP.5 38.58,33.21 U3.30 | ICSP.5 35.95,35.85 35.95,40.95 35.96,40.96
  Top 0.406: C1.1 R8.1 C20.1
  Top 0.813: SW1.2 35.96,40.96 SW1.4
  Bottom 0.305: v40.49,37.02 39.73,37.02 ICSP.5
RX0
  Top 0.305: U3.2 45.45,15.33 R13.1
RX1
  Top 0.305: U3.45 31.08,30.24 29.7,31.62 26.58,31.62 25.12,30.16 23.03,30.16 21.41,31.78 R18.1
  Top 0.406: T1.3 19.12,32.27 | 20.36,32.2 20.36,32.1 R18.1
  Top 0.61: 19.12,32.27 20.29,32.27 20.36,32.2
RX2  (via drill 0.33)
  Top 0.305: v34.58,20.45 34.84,20.7 41.06,20.7 41.43,20.33 U3.12 | v19.09,6.22 19.09,10.99 22.96,14.86 22.96,18.29 v24.3,19.62
  Bottom 0.305: JP9.3 14.17,6.22 v19.09,6.22 | v24.3,19.62 27.98,19.62 30.46,22.1 33.95,22.1 34.58,21.46 v34.58,20.45
RX3
  Top 0.305: U3.63 23.79,20.83 21.95,18.99 21.95,15.56 17.82,11.43 17.82,4.89 16.61,3.68 14.23,3.68 JP8.3
RX_XBEE
  Top 0.305: R19.1 12.82,34.51 R20.2 5.57,41.75 XB1.3
SCL_3V3
  Top 0.305: R2.1 15.34,24 15.66,24.32 15.66,25.27 15.28,25.66 14.48,25.66 U1.3 10.89,25.64 5.37,20.13 JP11.4 | U2.23 6.02,17.54 JP11.4 | U6.6 12.42,12.83 12.3,12.7 6.52,12.7 6.07,13.15 4.68,13.15 4.1,13.72 4.1,15.05 5.18,16.13 5.18,16.7 JP11.4
SCL_5  (via drill 0.33)
  Top 0.305: v30.33,26.04 30.97,26.04 32.08,27.16 U3.43 | v23.22,24.07 21.69,24.07 20.87,24.89 20.87,25.62 R6.1 18.9,25.66 U1.6 17.95,25.66 17.63,25.97 17.63,27.31 16.74,28.2 11.6,28.2 2.83,19.43 JP10.4
  Bottom 0.305: v30.33,26.04 25.19,26.04 v23.22,24.07
SDA_3V3  (via drill 0.33)
  Top 0.305: U1.4 12.98,25.01 12.68,24.7 R5.1 10.74,23.85 7.22,20.32 v7.22,19.31 | U2.24 13.32,17.02 12.61,17.02 11.15,15.56 U6.7 5.79,13.94 JP11.3
  Bottom 0.305: v7.22,19.31 7.22,16.19 JP11.3
SDA_5  (via drill 0.33)
  Top 0.305: v21.12,23.31 20.01,23.31 R7.1 19.98,24.7 19.67,25.01 U1.5 17.83,25.01 17.12,25.72 17.12,27.12 16.61,27.62 11.92,27.62 4.1,19.81 4.1,16.13 2.83,14.86 JP10.3 | v29.38,27.05 31.16,27.05 31.58,27.48 U3.44
  Bottom 0.305: v29.38,27.05 24.87,27.05 v21.12,23.31
TX
  Top 0.305: U4.23 42.12,47.73 40.81,46.42 38.9,46.42 37.63,47.69 TX.C
TX0
  Top 0.305: R14.1 44.74,16.38 44.19,15.83 U3.3
TX1
  Top 0.305: 14.07,33.45 R19.2 14.01,31.69 16.17,29.53 25.38,29.53 26.9,31.05 29.5,31.05 30.58,29.97 U3.46
TX2  (via drill 0.33)
  Top 0.305: v33.63,21.27 41.19,21.27 41.63,20.83 U3.13 | v19.09,5.27 19.34,5.27 19.85,5.78 19.85,10.92 23.47,14.54 23.47,17.91 24.49,18.92 v25.19,18.92
  Bottom 0.305: JP9.4 15.82,5.27 v19.09,5.27 | v25.19,18.92 28.17,18.92 30.52,21.27 v33.63,21.27
TX3
  Top 0.305: U3.64 23.99,20.33 22.46,18.8 22.46,15.24 18.33,11.11 18.33,4.64 16.11,2.42 JP8.4
TX_XBEE
  Top 0.305: 18.08,35.91 13.4,35.91 XB1.2
  Top 0.406: T1.2 18.08,35.91 R17.1
USB_VCC
  Top 0.305: U4.4 40.81,41.38 40.81,43.12 | 40.81,43.12 42.33,44.64 | 42.33,44.64 42.46,44.77 | U4.20 44.07,45.32 44.11,45.28 44.11,44.64 | 40.93,44.07 40.81,43.94 40.81,43.12 | 45.13,44.77 45,44.64 44.11,44.64 | 44.11,44.64 42.33,44.64
  Top 1.016: F1.2 50.97,41.09 52.49,39.56 JP7.1 | C9.+ 46.52,38.78 46.52,39.44 46.65,39.31 47.54,39.31 47.54,37.91 46.65,37.02 46.65,36.77 50.33,40.45 50.33,41.47 51.6,41.47 51.09,40.96 48.81,40.96 48.17,41.59 48.17,43.12 46.52,44.77 45.13,44.77 | 44.62,44.77 41.63,44.77 40.93,44.07
  pour Top: 56.3,42.1 45.89,42.1 45.89,36.39 49.19,36.39 51.03,38.23 56.3,38.29
  cutout Top: 45.13,44.39 45.06,45.15 45.44,44.77 45.44,44.71
VUSB
  Top 0.406: USB.1 51.7,44.23 51.6,44.13
  Top 0.61: 51.6,44.13 51.22,44.13 50.97,43.88 50.59,43.88 50.21,43.5 51.09,43.5 51.35,43.75 51.35,42.86 50.08,42.86 50.42,43.21 F1.1
  pour Top: 50.97,44.39 48.43,44.39 48.43,42.61 50.97,42.61
XTAL1
  Top 0.305: U3.34 36.58,30.01 35.41,31.18 31.09,31.18 29.89,32.39 25.76,32.39 25.19,32.96 25.19,37.66 26.18,38.65 Q1.1
  Top 0.406: 26.18,38.65 26.14,38.69 C4.2
XTAL2
  Top 0.305: U3.33 37.08,30.71 35.92,31.88 31.36,31.88 Q1.3 30.46,35.72 30.46,39.88 29.41,40.93 C17.1

### Text on the board
tNames: RESET | 2 | C1 | 1 | 13 | 12 | X | 11 | Z | 8 | Y | 7 | C6 | SCL | 6 | SDA | 46 | + | 45 | U6 | C5 | - | 44 | A8 | A7 | A6 | A5 | A4 | A3 | A2 | A1 | A0 | 5V | 3V3 | s | + | - | RX | TX | - | + | + | 2 | 3 | -
bNames: BREEZE UAV Board / Vers.1.0
ReferenceLC: L | TX | RX | PC1 | PC2